# Altium schematic sheet STM32G473RETx_LQFP64_MCU.SchDoc: STM32G473CETx Microcontroller
size A4
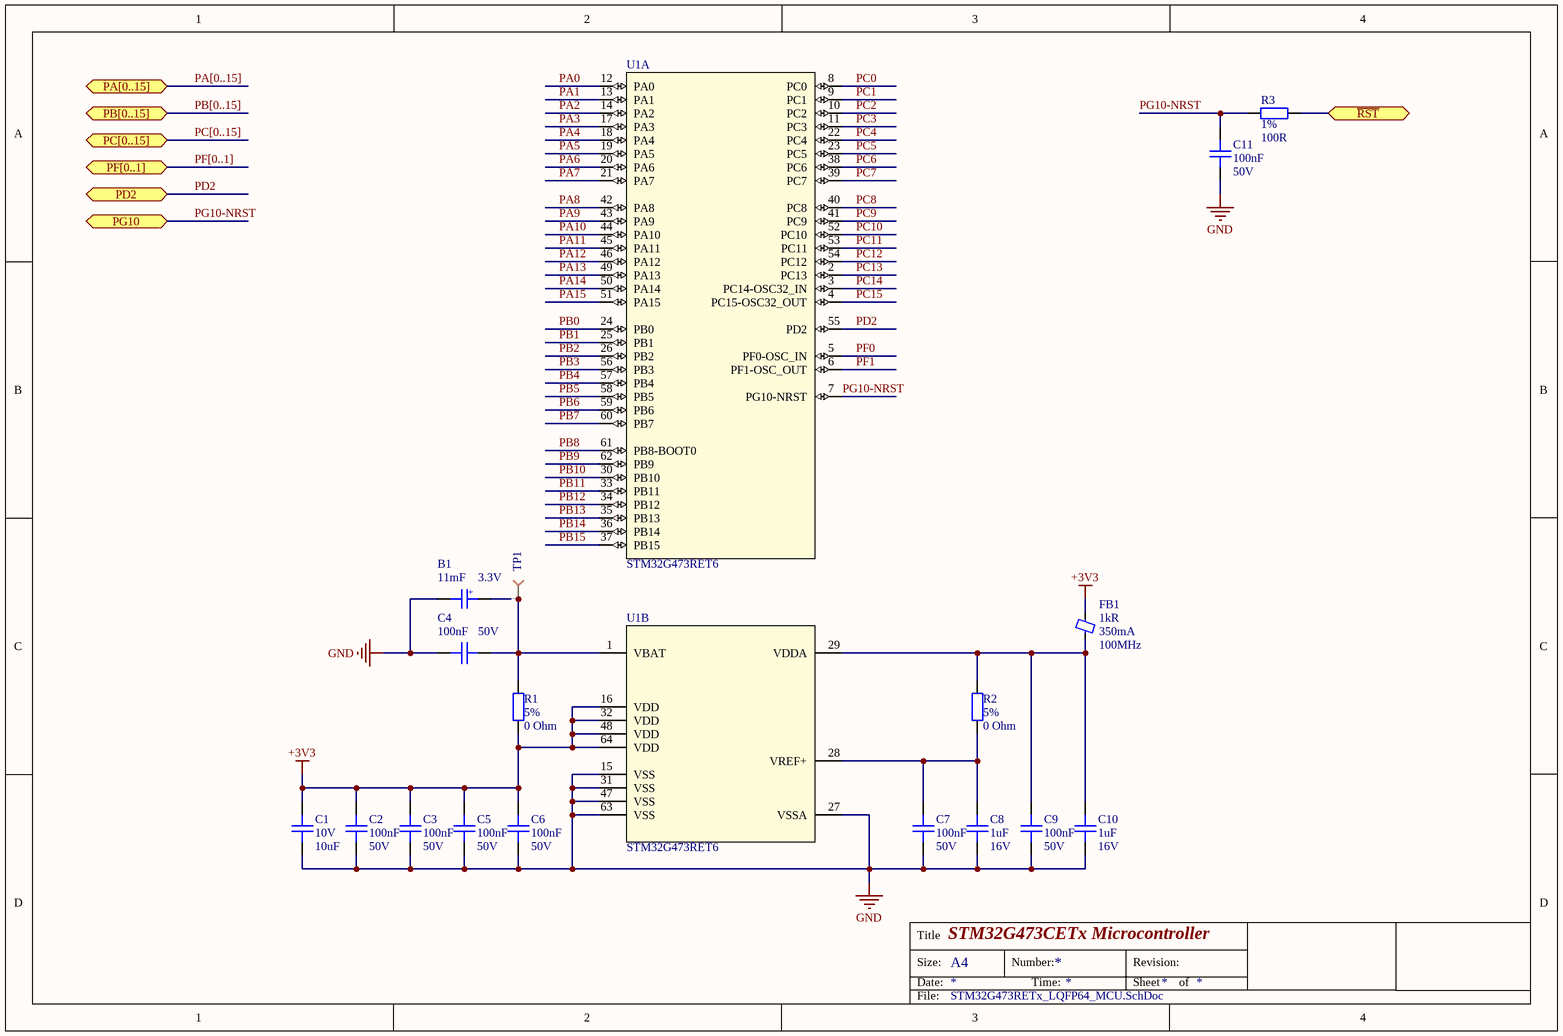
[diagram p0: STM32G473RETx_LQFP64_MCU.SchDoc]

## Parts
B1  Capacitance: 11mF  Voltage Rating: 3.3V  [CAPCP3225X100N]  (hidden comment: CAP 11MF 3.3V SURFACE MNT)
C1  Voltage Rating: 10V  Capacitance: 10uF  [C0805]  (hidden comment: CAP CER 10uF X7R 10% 0805)
C2  Capacitance: 100nF  Voltage: 50V  [C0402]  (hidden comment: CAP CER 0.1UF 50V X7R 0402)
C3  Capacitance: 100nF  Voltage: 50V  [C0402]  (hidden comment: CAP CER 0.1UF 50V X7R 0402)
C4  Capacitance: 100nF  Voltage: 50V  [C0402]  (hidden comment: CAP CER 0.1UF 50V X7R 0402)
C5  Capacitance: 100nF  Voltage: 50V  [C0402]  (hidden comment: CAP CER 0.1UF 50V X7R 0402)
C6  Capacitance: 100nF  Voltage: 50V  [C0402]  (hidden comment: CAP CER 0.1UF 50V X7R 0402)
C7  Capacitance: 100nF  Voltage: 50V  [C0402]  (hidden comment: CAP CER 0.1UF 50V X7R 0402)
C8  Capacitance: 1uF  Voltage Rating: 16V  [C0402]  (hidden comment: CAP CER 1UF 16V X5R 0402)
C9  Capacitance: 100nF  Voltage: 50V  [C0402]  (hidden comment: CAP CER 0.1UF 50V X7R 0402)
C10  Capacitance: 1uF  Voltage Rating: 16V  [C0402]  (hidden comment: CAP CER 1UF 16V X5R 0402)
C11  Capacitance: 100nF  Voltage: 50V  [C0402]  (hidden comment: CAP CER 0.1UF 50V X7R 0402)
FB1  Impedance: 1kR  Max DC Current: 350mA  Test Frequency: 100MHz  [L0402]  (hidden comment: FERRITE BEAD 1 KOHM 0402 1LN)
R1  Tolerance: 5%  Resistance: 0 Ohm  [R0402]  (hidden comment: RES SMD 0 OHM JUMPER 1/16W 0402)
R2  Tolerance: 5%  Resistance: 0 Ohm  [R0402]  (hidden comment: RES SMD 0 OHM JUMPER 1/16W 0402)
R3  Tolerance: 1%  Resistance: 100R  [R0402]  (hidden comment: RES SMD 100 OHM 1% 1/16W 0402)
TP1  Test Point Pad  [Testpoint]  (value not drawn)  (no BOM)
U1  STM32G473RET6  [LQFP64-10x10mm]  (parts A,B of 2)

## Ports
PA[0..15] (bidir), PB[0..15] (bidir), PC[0..15] (bidir), PD2 (bidir), PF[0..1] (bidir), PG10 (bidir), ~{RST} (bidir)

## Nets
+3V3: C1.1 C2.1 C3.1 C5.1 C6.1 FB1.2 R1.1 U1.16(VDD) U1.32(VDD) U1.48(VDD) U1.64(VDD)
GND: B1.2 C1.2 C2.2 C3.2 C4.2 C5.2 C6.2 C7.1 C8.1 C9.1 C10.1 C11.2 U1.15(VSS) U1.27(VSSA) U1.31(VSS) U1.47(VSS) U1.63(VSS)
~{RST}: R3.1 ; port ~{RST}
PA0: U1.12(PA0)
PA1: U1.13(PA1)
PA2: U1.14(PA2)
PA3: U1.17(PA3)
PA4: U1.18(PA4)
PA5: U1.19(PA5)
PA6: U1.20(PA6)
PA7: U1.21(PA7)
PA8: U1.42(PA8)
PA9: U1.43(PA9)
PA10: U1.44(PA10)
PA11: U1.45(PA11)
PA12: U1.46(PA12)
PA13: U1.49(PA13)
PA14: U1.50(PA14)
PA15: U1.51(PA15)
PB0: U1.24(PB0)
PB1: U1.25(PB1)
PB2: U1.26(PB2)
PB3: U1.56(PB3)
PB4: U1.57(PB4)
PB5: U1.58(PB5)
PB6: U1.59(PB6)
PB7: U1.60(PB7)
PB8: U1.61(PB8-BOOT0)
PB9: U1.62(PB9)
PB10: U1.30(PB10)
PB11: U1.33(PB11)
PB12: U1.34(PB12)
PB13: U1.35(PB13)
PB14: U1.36(PB14)
PB15: U1.37(PB15)
PC0: U1.8(PC0)
PC1: U1.9(PC1)
PC2: U1.10(PC2)
PC3: U1.11(PC3)
PC4: U1.22(PC4)
PC5: U1.23(PC5)
PC6: U1.38(PC6)
PC7: U1.39(PC7)
PC8: U1.40(PC8)
PC9: U1.41(PC9)
PC10: U1.52(PC10)
PC11: U1.53(PC11)
PC12: U1.54(PC12)
PC13: U1.2(PC13)
PC14: U1.3(PC14-OSC32_IN)
PC15: U1.4(PC15-OSC32_OUT)
PD2: U1.55(PD2) ; port PD2
PF0: U1.5(PF0-OSC_IN)
PF1: U1.6(PF1-OSC_OUT)
PG10-NRST: C11.1 R3.2 U1.7(PG10-NRST) ; port PG10
NetB1_1: B1.1 C4.1 R1.2 TP1.1 U1.1(VBAT)
NetC7_2: C7.2 C8.2 R2.1 U1.28(VREF+)
NetC9_2: C9.2 C10.2 FB1.1 R2.2 U1.29(VDDA)

## Buses and harness runs
bus PA[0..15] = port PA[0..15]
bus PB[0..15] = port PB[0..15]
bus PC[0..15] = port PC[0..15]
bus PF[0..1] = port PF[0..1]

## Notes on the sheet
- Title
- Size:
- Date:
- A4
- Number:
- Time:
- Revision:
- Sheet
- of
- File:
- (in symbol CAP 11MF 3.3V SURFACE MNT) +

## Library data of the parts
B1 = CAP 11MF 3.3V SURFACE MNT: 11mF (EDLC) Supercapacitor 3.3V 1210 (3225 Metric); Manufacturer: Seiko; Manufacturer Part Number: CPH3225A; ESR (Equivalent Series Resistance): 160R; Supplier 1: Digi-Key; Stock 1: 48098; Pricing 1: 1=2.02, 10=1.634, 50=1.4256, 100=1.2474, 500=0.9504, 1000=0.8316, 2500=0.8019, 5000=0.7722 (USD); Mount: Surface Mount; Case/Package: 1210; Min Operating Temperature: -20°C; Max Operating Temperature: 60°C; Package Quantity: 2000; Termination: SMD/SMT; ComponentLink1URL: http://www.sii.co.jp/en/me/datasheets/chip-capacitor/cph3225a/?src-supplier=Mouser; ComponentLink1Description: http://www.sii.co.jp/en/me/datasheets/chip-capacitor/cph3225a/?src-supplier=Mouser; Supplier Part Number 1: 728-1127-1-ND; Case Code (Metric): 3225; Case Code (Imperial): 1210; Packaging: Tape and Reel; Voltage Rating (DC): 3.3V; Length: 3.2mm; Height: 0.9mm; Width: 2.5mm; Height - Seated (Max): 0.035inch; ComponentLink2URL: http://www.sii-components.com/document/en/battery/Chip_Capacitor_E.pdf?src-supplier=Avnet+Asia; ComponentLink2Description: http://www.sii-components.com/document/en/battery/Chip_Capacitor_E.pdf?src-supplier=Avnet+Asia; ComponentLink3URL: https://media.digikey.com/pdf/Data%20Sheets/Seiko%20Instruments%20PDFs/CPH3225A_CP3225A.pdf?src-supplier=Digi-Key; ComponentLink3Description: https://media.digikey.com/pdf/Data%20Sheets/Seiko%20Instruments%20PDFs/CPH3225A_CP3225A.pdf?src-supplier=Digi-Key
C1 = CAP CER 10uF X7R 10% 0805: Capacitor,10uF,10V,X7R,10%,0805,Murata; Manufacturer Part Number: GRM21BR71A106KA73L; Supplier 1: Digi-Key; Manufacturer: Murata; Stock 1: 2099435; Pricing 1: 1=0.26, 10=0.176, 100=0.089, 500=0.0609, 1000=0.0538 (USD); Mount: Surface Mount; Case Code (Imperial): 0805; Case Code (Metric): 2012; Min Operating Temperature: -55°C; Max Operating Temperature: 125°C; Voltage Rating (DC): 10V; Tolerance: 10%; Packaging: Tape and Reel; Package Quantity: 3000; Dielectric: X7R; Termination: SMD/SMT; Length: 2mm; Height: 1.25mm; Width: 1.25mm; Thickness: 0.055inch; Depth: 1.25mm; REACH SVHC: No SVHC; ComponentLink1URL: http://components.arrow.com/part/dataview/0323_07281730?src-supplier=Arrow+Europe; ComponentLink1Description: http://components.arrow.com/part/dataview/0323_07281730?src-supplier=Arrow+Europe; ComponentLink2URL: http://www.mouser.com/ds/2/281/c02e-2905.pdf?src-supplier=Mouser; ComponentLink2Description: http://www.mouser.com/ds/2/281/c02e-2905.pdf?src-supplier=Mouser; ComponentLink3URL: http://www.farnell.com/datasheets/2079188.pdf?src-supplier=Newark; ComponentLink3Description: http://www.farnell.com/datasheets/2079188.pdf?src-supplier=Newark; ComponentLink4URL: http://www.farnell.com/datasheets/2079188.pdf?src-supplier=Farnell; ComponentLink4Description: http://www.farnell.com/datasheets/2079188.pdf?src-supplier=Farnell; Supplier Part Number 1: 490-10516-1-ND; Case/Package: 0805; ComponentLink5URL: http://www.farnell.com/datasheets/2079188.pdf?src-supplier=Element14; ComponentLink5Description: http://www.farnell.com/datasheets/2079188.pdf?src-supplier=Element14; Weight: 0.000335oz; ComponentLink6URL: http://search.murata.co.jp/Ceramy/image/img/A01X/G101/ENG/GRM21BR71A106KA73-01.pdf?src-supplier=Digi-Key; ComponentLink6Description: http://search.murata.co.jp/Ceramy/image/img/A01X/G101/ENG/GRM21BR71A106KA73-01.pdf?src-supplier=Digi-Key
C2-C7 C9 C11 = CAP CER 0.1UF 50V X7R 0402: 0.1µF ±10% 50V Ceramic Capacitor X7R 0402 (1005 Metric); Manufacturer: TDK; Manufacturer Part Number: CGA2B3X7R1H104K050BB; Supplier 1: Digi-Key; Stock 1: 2925303; Pricing 1: 1=0.17, 10=0.118, 50=0.0668, 100=0.0553, 500=0.0388, 1000=0.0321, 2500=0.0299, 5000=0.0273 (USD); Mount: Surface Mount; Case/Package: 0402; Weight: 2.3E-05oz; Case Code (Metric): 1005; Case Code (Imperial): 0402; Min Operating Temperature: -55°C; Max Operating Temperature: 125°C; Voltage Rating: 50V; Tolerance: 10%; Packaging: Tape and Reel; Package Quantity: 1; Voltage Rating (DC): 50V; Dielectric: X7R; Termination: SMD/SMT; Composition: Ceramic; Length: 1mm; Height: 0.5mm; Width: 0.02inch; Thickness: 0.022inch; Depth: 0.5mm; Ratings: AEC-Q200; REACH SVHC: No SVHC; Lead Free: Lead Free; ComponentLink1URL: http://product.tdk.com/capacitor/mlcc/en/documents/mlccspec_automotive_general_midvoltage_en.pdf?src-supplier=Future+Electronics; ComponentLink1Description: http://product.tdk.com/capacitor/mlcc/en/documents/mlccspec_automotive_general_midvoltage_en.pdf?src-supplier=Future+Electronics; ComponentLink2URL: http://www.farnell.com/datasheets/1807242.pdf?src-supplier=Element14; ComponentLink2Description: http://www.farnell.com/datasheets/1807242.pdf?src-supplier=Element14; ComponentLink3URL: http://www.mouser.com/ds/2/400/lcc_automotive_general_en-843974.pdf?src-supplier=Mouser; ComponentLink3Description: http://www.mouser.com/ds/2/400/lcc_automotive_general_en-843974.pdf?src-supplier=Mouser; ComponentLink4URL: http://www.farnell.com/datasheets/1936565.pdf?src-supplier=Element14; ComponentLink4Description: http://www.farnell.com/datasheets/1936565.pdf?src-supplier=Element14; ComponentLink5URL: http://www.farnell.com/datasheets/1735392.pdf?src-supplier=Element14; ComponentLink5Description: http://www.farnell.com/datasheets/1735392.pdf?src-supplier=Element14; Supplier Part Number 1: 445-6899-1-ND
C8 C10 = CAP CER 1UF 16V X5R 0402: 1µF ±10% 16V Ceramic Capacitor X5R 0402 (1005 Metric); Manufacturer: Yageo; Manufacturer Part Number: CC0402KRX5R7BB105; Supplier 1: Digi-Key; Stock 1: 1114963; Pricing 1: 1=0.4, 10=0.278, 100=0.167, 500=0.1253, 1000=0.1058, 2500=0.1002, 5000=0.0947 (USD); Mount: Surface Mount; Weight: 2.3E-05oz; Case Code (Imperial): 0402; Case Code (Metric): 1005; Min Operating Temperature: -55°C; Max Operating Temperature: 85°C; Tolerance: 10%; Packaging: Tape and Reel; Voltage Rating (DC): 16V; Dielectric: X5R; Termination: SMD/SMT; Composition: Ceramic; Length: 1mm; Height: 0.5mm; Width: 0.02inch; Depth: 0.5mm; Thickness: 0.022inch; Radiation Hardening: No; Lead Free: Lead Free; Halogen Free: Halogen Free; ComponentLink1URL: http://www.yageo.com/documents/recent/UPY-GPHC_X5R_4V-to-50V_12.pdf?src-supplier=Avnet+Europe; ComponentLink1Description: http://www.yageo.com/documents/recent/UPY-GPHC_X5R_4V-to-50V_12.pdf?src-supplier=Avnet+Europe; Supplier Part Number 1: 311-1691-1-ND; Case/Package: 0402
FB1 = FERRITE BEAD 1 KOHM 0402 1LN: 1 kOhms @ 100MHz 1  Ferrite Bead 0402 (1005 Metric) 350mA 490mOhm; Manufacturer: Murata; Manufacturer Part Number: BLM15AX102SN1D; Material: Ferrite,Steel; Tolerance: 25%; Number of Lines: 1; DC Resistance (DCR): 490mR; Supplier 1: Digi-Key; Stock 1: 138597; Pricing 1: 1=0.11, 10=0.09, 25=0.0812, 50=0.0596, 100=0.0514, 250=0.0406, 500=0.0343, 1000=0.0289, 5000=0.0257 (USD); Case/Package: 0402; Number of Pins: 2; Case Code (Metric): 1005; Case Code (Imperial): 0402; Min Operating Temperature: -55°C; Max Operating Temperature: 125°C; Package Quantity: 1; Packaging: Tape and Reel; Current Rating: 350mA; Max Current Rating: 350mA; Termination: SMD/SMT; Number of Circuits: 1; Length: 1mm; Height: 0.5mm; Width: 0.5mm; Depth: 0.5mm; REACH SVHC: No SVHC; Lead Free: Lead Free; ComponentLink1URL: https://www.murata.com/en-us/products/productdata/8796740059166/ENFA0018.pdf?src-supplier=Digi-Key; ComponentLink1Description: https://www.murata.com/en-us/products/productdata/8796740059166/ENFA0018.pdf?src-supplier=Digi-Key; ComponentLink2URL: http://search.murata.co.jp/Ceramy/image/img/PDF/ENG/L0110S0100BLM15AX_SN.pdf?src-supplier=Future+Electronics; ComponentLink2Description: http://search.murata.co.jp/Ceramy/image/img/PDF/ENG/L0110S0100BLM15AX_SN.pdf?src-supplier=Future+Electronics; ComponentLink3URL: http://www.produktinfo.conrad.com/datenblaetter/1100000-1199999/001171674-da-01-en-CHIP_DROSSEL0402_1000R_350MA_1_0X0_5MM.pdf?src-supplier=Conrad; ComponentLink3Description: http://www.produktinfo.conrad.com/datenblaetter/1100000-1199999/001171674-da-01-en-CHIP_DROSSEL0402_1000R_350MA_1_0X0_5MM.pdf?src-supplier=Conrad; ComponentLink4URL: http://www.produktinfo.conrad.com/datenblaetter/1100000-1199999/001172166-da-01-en-DROSSEL_0402_1000R_31_0X0_5MM_10000ST.pdf?src-supplier=Conrad; ComponentLink4Description: http://www.produktinfo.conrad.com/datenblaetter/1100000-1199999/001172166-da-01-en-DROSSEL_0402_1000R_31_0X0_5MM_10000ST.pdf?src-supplier=Conrad; Supplier Part Number 1: 490-5442-1-ND; Mount: Surface Mount
R1 R2 = RES SMD 0 OHM JUMPER 1/16W 0402: 0 Ohms Jumper 0.063W, 1/16W Chip Resistor 0402 (1005 Metric) Moisture Resistant Thick Film; Manufacturer: Yageo; Manufacturer Part Number: RC0402JR-070RL; Power Rating: 62.5mW; Voltage Rating: 50V; Max Power Dissipation: 63mW; Temperature Coefficient: 200ppm/°C; Supplier 1: Digi-Key; Stock 1: 46057148; Pricing 1: 1=0.1, 10=0.013, 25=0.0092, 50=0.0072, 100=0.0053, 250=0.004, 500=0.0032, 1000=0.0024, 5000=0.0017 (USD); Contact Plating: Tin,Matte; Case Code (Metric): 1005; Case Code (Imperial): 0402; Min Operating Temperature: -55°C; Max Operating Temperature: 155°C; Packaging: Tape and Reel; Composition: Thick Film; Package Quantity: 1; Number of Terminations: 2; Termination: SMD/SMT; Military Standard: Not; Features: Moisture Resistant; Length: 1mm; Height: 0.016inch; Width: 0.02inch; Depth: 0.5mm; Radiation Hardening: No; REACH SVHC: Unknown; Lead Free: Lead Free; ComponentLink1URL: http://www.yageo.com/documents/recent/PYu-RC_Group_51_RoHS_L_10.pdf?src-supplier=Digi-Key; ComponentLink1Description: http://www.yageo.com/documents/recent/PYu-RC_Group_51_RoHS_L_10.pdf?src-supplier=Digi-Key; ComponentLink2URL: http://www.yageo.com/documents/recent/PYu-RC0402_51_RoHS_L_6.pdf?src-supplier=Avnet+Europe; ComponentLink2Description: http://www.yageo.com/documents/recent/PYu-RC0402_51_RoHS_L_6.pdf?src-supplier=Avnet+Europe; ComponentLink3URL: http://www.farnell.com/datasheets/1018594.pdf?src-supplier=Element14; ComponentLink3Description: http://www.farnell.com/datasheets/1018594.pdf?src-supplier=Element14; ComponentLink4URL: https://www.verical.com/server-webapp/html/getDatasheet?partID=326379&src-supplier=Verical; ComponentLink4Description: https://www.verical.com/server-webapp/html/getDatasheet?partID=326379&src-supplier=Verical; ComponentLink5URL: http://www.farnell.com/datasheets/2167052.pdf?src-supplier=Element14; ComponentLink5Description: http://www.farnell.com/datasheets/2167052.pdf?src-supplier=Element14; Supplier Part Number 1: 311-0.0JRCT-ND; Case/Package: 0402; Mount: Surface Mount
R3 = RES SMD 100 OHM 1% 1/16W 0402: 100 Ohms ±1% 0.063W, 1/16W Chip Resistor 0402 (1005 Metric) Moisture Resistant Thick Film; Manufacturer: Yageo; Manufacturer Part Number: RC0402FR-07100RL; Power Rating: 62.5mW; Voltage Rating: 50V; Temperature Coefficient: 100ppm/°C; Supplier 1: Digi-Key; Stock 1: 16989760; Pricing 1: 1=0.1, 10=0.016, 100=0.0064, 1000=0.0029, 2500=0.0025, 5000=0.0021 (USD); Case/Package: 0402; Number of Pins: 2; Case Code (Imperial): 0402; Case Code (Metric): 1005; Min Operating Temperature: -55°C; Max Operating Temperature: 155°C; Voltage Rating (DC): 50V; Packaging: Tape and Reel; Termination: SMD/SMT; Composition: Thick Film; Military Standard: Not; Length: 1mm; Height: 0.32mm; Width: 0.5mm; Depth: 0.5mm; REACH SVHC: No SVHC; Lead Free: Lead Free; ComponentLink1URL: http://www.farnell.com/datasheets/2167052.pdf?src-supplier=Element14; ComponentLink1Description: http://www.farnell.com/datasheets/2167052.pdf?src-supplier=Element14; ComponentLink2URL: http://www.yageo.com/documents/recent/PYu-RC_Group_51_RoHS_L_9.pdf?src-supplier=Mouser; ComponentLink2Description: http://www.yageo.com/documents/recent/PYu-RC_Group_51_RoHS_L_9.pdf?src-supplier=Mouser; ComponentLink3URL: http://www.yageo.com/documents/recent/PYu-RC0402_51_RoHS_L_6_r.pdf?src-supplier=Future+Electronics; ComponentLink3Description: http://www.yageo.com/documents/recent/PYu-RC0402_51_RoHS_L_6_r.pdf?src-supplier=Future+Electronics; ComponentLink4URL: https://www.verical.com/server-webapp/html/getDatasheet?partID=329466&src-supplier=Verical; ComponentLink4Description: https://www.verical.com/server-webapp/html/getDatasheet?partID=329466&src-supplier=Verical; ComponentLink5URL: http://www.farnell.com/datasheets/1018594.pdf?src-supplier=Element14; ComponentLink5Description: http://www.farnell.com/datasheets/1018594.pdf?src-supplier=Element14; ComponentLink6URL: http://documents.rs-components.com/techlib://itc_doclist_GB.htm?stockno=6185810&src-supplier=RSComponents; ComponentLink6Description: http://documents.rs-components.com/techlib://itc_doclist_GB.htm?stockno=6185810&src-supplier=RSComponents; Supplier Part Number 1: 311-100LRDKR-ND; Mount: Surface Mount
TP1 = Test Point Pad: Test Point. There is nothing to buy or mount.; ClassName: TestPoint; CompType: TestPoint; Manufacturer: N/A; MountType: N/A; PackageReference: TetsPoint; PartNumber: N/A
U1 = IC STM32G473RETx LQFP64: ARM® Cortex®-M4 STM32G4 Microcontroller IC 32-Bit 170MHz 512KB (512K x 8) FLASH 64-LQFP (10x10); Manufacturer: STMicroelectronics; Data RAM Size: 128 kB; Data RAM Type: SRAM; Interface Type: I2C, SPI, UART, USART, USB; Number of I/Os: 52 I/O; ADC Resolution: 12 bit; Analog Supply Voltage: 1.62 V to 3.6 V; Core: ARM Cortex M4; Data Bus Width: 32 bit; I/O Voltage: 5 V; Number of ADC Channels: 26 Channel; Operating Supply Voltage: 1.71 V to 3.6 V; Supply Voltage - Max: 3.6 V; Supply Voltage - Min: 1.71 V; Watchdog Timers: Watchdog Timer, Windowed; Product Status: New Product; Supplier 1: Mouser; Manufacturer Part Number: STM32G473RET6; RoHS: RoHS Compliant; Category: ARM Microcontrollers - MCU; Stock 1: 313; Pricing 1: 1=7.73, 10=6.99, 25=6.66, 100=5.79, 250=5.53, 500=5.04, 1000=4.54, 2500=4.22 (USD); Package / Case: LQFP-64; Packaging: Tray; Product: MCU+FPU; Program Memory Type: Flash; Series: STM32G473RE; Brand: STMicroelectronics; Mounting Style: SMD/SMT; Program Memory Size: 512 kB; DAC Resolution: 12 bit; Maximum Clock Frequency: 170 MHz; Maximum Operating Temperature: + 85 C; Minimum Operating Temperature: - 40 C; Moisture Sensitive: Yes; Processor Series: STM32G473; Product Type: ARM Microcontrollers - MCU; Standard Pack Qty: 960; Subcategory: Microcontrollers - MCU; Tradename: STM32; RoHS - Mouser: Y; Minimum Order Quantity: 1; Reeling: False; ComponentLink1URL: https://www.mouser.com/datasheet/2/389/dm00528822-1799294.pdf; ComponentLink1Description: https://www.mouser.com/datasheet/2/389/dm00528822-1799294.pdf; Supplier 2: Digi-Key; Supplier Part Number 1: 511-STM32G473RET6; Supplier Part Number 2: 497-STM32G473RET6-ND; Mount: Surface Mount